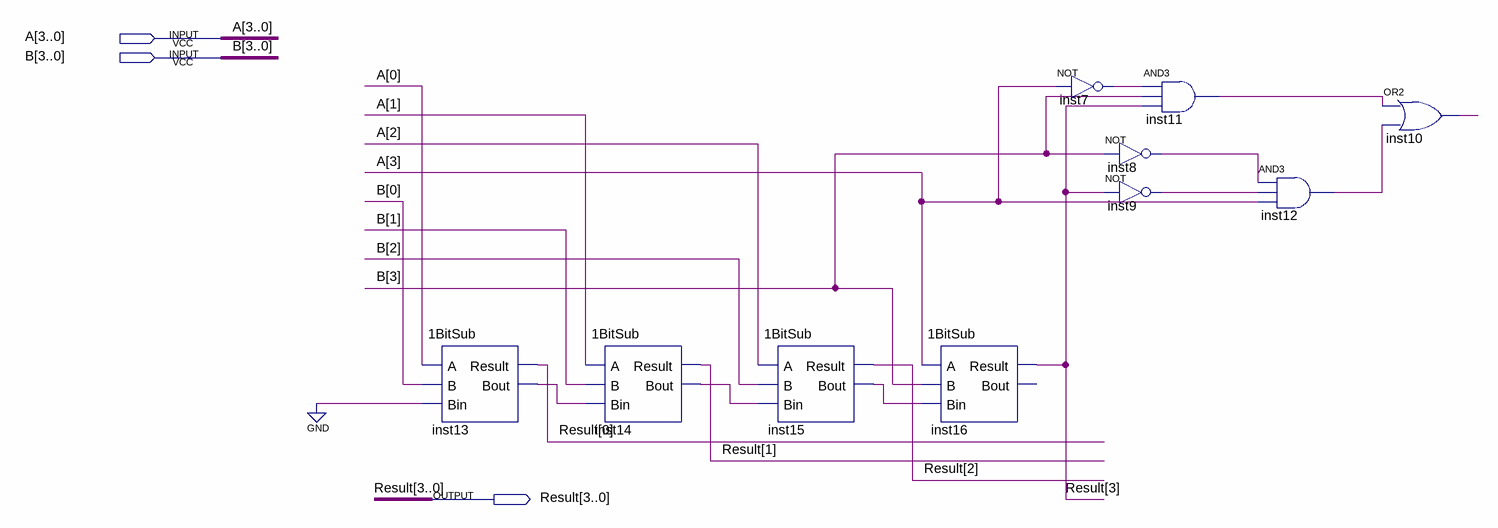
[diagram p0: schematic sheet]
// Quartus schematic Sub4_bit.bdf as structural Verilog: 10 symbols, 3 pins
module Sub4_bit (
  input  [3:0] A,
  input  [3:0] B,
  output [3:0] Result
);

  wire inst7_out, inst8_out, inst9_out, inst10_out, inst11_out, inst12_out, inst13_bout, inst14_bout,
       inst15_bout;

  \1BitSub  inst13 (.A(A[0]), .B(B[0]), .Bin(1'b0), .Result(Result[0]), .Bout(inst13_bout));
  \1BitSub  inst14 (.A(A[1]), .B(B[1]), .Bin(inst13_bout), .Result(Result[1]), .Bout(inst14_bout));
  \1BitSub  inst15 (.A(A[2]), .B(B[2]), .Bin(inst14_bout), .Result(Result[2]), .Bout(inst15_bout));
  \1BitSub  inst16 (.A(A[3]), .B(B[3]), .Bin(inst15_bout), .Result(Result[3]));  // open: Bout
  not inst7 (inst7_out, A[3]);
  and inst11 (inst11_out, inst7_out, B[3], Result[3]);
  not inst8 (inst8_out, B[3]);
  not inst9 (inst9_out, Result[3]);
  and inst12 (inst12_out, inst8_out, inst9_out, A[3]);
  or inst10 (inst10_out, inst11_out, inst12_out);
endmodule
